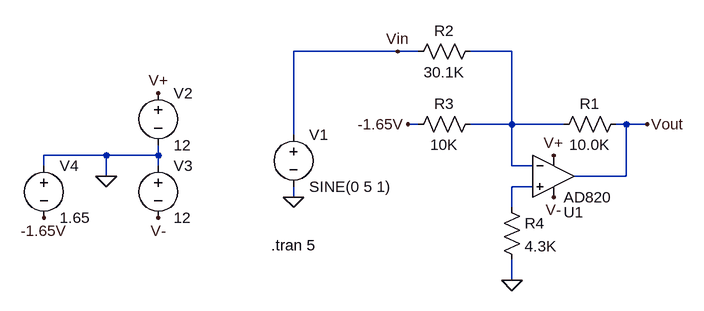
[diagram p0: schematic output2.asc]
output2.asc, the LTspice schematic file:
Version 4
SHEET 1 880 680
WIRE -96 48 -256 48
WIRE -64 48 -96 48
WIRE 80 48 16 48
WIRE -64 160 -80 160
WIRE 80 160 80 48
WIRE 80 160 16 160
WIRE 160 160 80 160
WIRE 256 160 240 160
WIRE 288 160 256 160
WIRE -256 176 -256 48
WIRE -544 208 -640 208
WIRE -464 208 -464 192
WIRE -464 208 -544 208
WIRE -640 224 -640 208
WIRE -464 224 -464 208
WIRE 80 224 80 160
WIRE 112 224 80 224
WIRE -544 240 -544 208
WIRE 256 240 256 160
WIRE 256 240 176 240
WIRE 112 256 80 256
WIRE -256 272 -256 256
WIRE 80 288 80 256
WIRE 80 400 80 368
FLAG 144 208 V+
FLAG 144 272 V-
FLAG -96 48 Vin
FLAG 80 400 0
FLAG -80 160 -1.65V
FLAG 288 160 Vout
FLAG -256 272 0
FLAG -544 240 0
FLAG -464 112 V+
FLAG -464 304 V-
FLAG -640 304 -1.65V
SYMBOL res 256 144 R90
WINDOW 0 0 56 VBottom 2
WINDOW 3 32 56 VTop 2
SYMATTR InstName R1
SYMATTR Value 10.0K
SYMATTR SpiceLine tol=.1
SYMBOL Opamps\\AD820 144 176 R0
WINDOW 0 16 119 Left 2
SYMATTR InstName U1
SYMBOL res 32 32 R90
WINDOW 0 0 56 VBottom 2
WINDOW 3 32 56 VTop 2
SYMATTR InstName R2
SYMATTR Value 30.1K
SYMATTR SpiceLine tol=.1
SYMBOL res 32 144 R90
WINDOW 0 0 56 VBottom 2
WINDOW 3 32 56 VTop 2
SYMATTR InstName R3
SYMATTR Value 10K
SYMATTR SpiceLine tol=.1
SYMBOL voltage -256 160 R0
WINDOW 123 0 0 Left 0
WINDOW 39 0 0 Left 0
SYMATTR InstName V1
SYMATTR Value SINE(0 5 1)
SYMBOL voltage -464 96 R0
WINDOW 123 0 0 Left 0
WINDOW 39 0 0 Left 0
SYMATTR InstName V2
SYMATTR Value 12
SYMBOL voltage -464 208 R0
WINDOW 123 0 0 Left 0
WINDOW 39 0 0 Left 0
SYMATTR InstName V3
SYMATTR Value 12
SYMBOL voltage -640 208 R0
WINDOW 123 0 0 Left 0
WINDOW 39 0 0 Left 0
SYMATTR InstName V4
SYMATTR Value 1.65
SYMBOL res 64 272 R0
SYMATTR InstName R4
SYMATTR Value 4.3K
TEXT -290 346 Left 2 !.tran 5

The netlist it stands for:
* output2.asc
R1 Vout N001 10.0K tol=.1
XU1 N002 N001 V+ V- Vout AD820  ; pins In+ In- V+ V- OUT
R2 N001 Vin 30.1K tol=.1
R3 N001 -1.65V 10K tol=.1
V1 Vin 0 SINE(0 5 1)
V2 V+ 0 12
V3 0 V- 12
V4 0 -1.65V 1.65
R4 N002 0 4.3K
.tran 5
.backanno
.end